# EAGLE design remote board v2 (EAGLE 5.10)
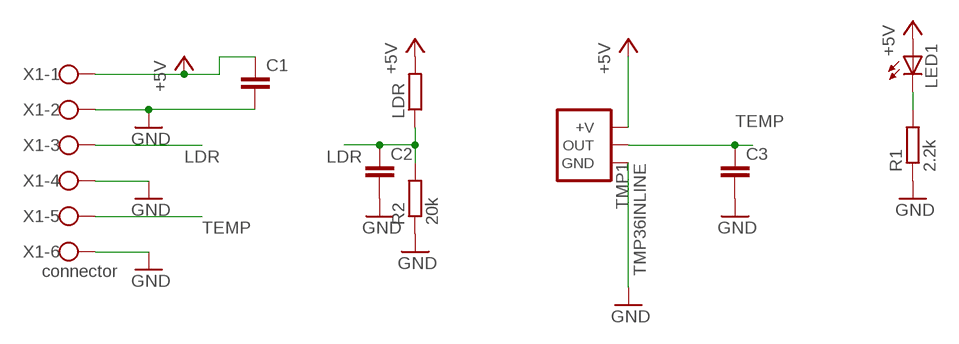
[diagram p0: schematic, sheet 1]

## Parts
C1  C-EU050-025X075  [C050-025X075]
C2  C-EU050-025X075  [C050-025X075]
C3  C-EU050-025X075  [C050-025X075]
LDR  R-EU_0204/7  [0204/7]
LED1  LED5MM  [LED5MM]
R1  2.2k  R-EU_0204/7  [0204/7]
R2  20k  R-EU_0204/7  [0204/7]
TMP1  TMP36INLINE  [TO92-INLINE]
X1  connector  W237-6  [W237-6]

## Nets
+5V [power]: C1.1 LDR.2 LED1.A TMP1.1(+V) X1.1
GND: C1.2 C2.2 C3.2 R1.1 R2.1 TMP1.3(GND) X1.2 X1.4 X1.6
LDR [power]: C2.1 LDR.1 R2.2 X1.3
N$1: LED1.K(C) R1.2
TEMP: C3.1 TMP1.2(OUT) X1.5

## Library data of the parts
C1-C3 = matt rcl:C-EU: CAPACITOR, European symbol
LDR R1 R2 = matt rcl:R-EU_: RESISTOR, European symbol
LED1 = matt led:LED: LED OSRAM: - CHIPLED LG R971, LG N971, LY N971, LG Q971, LY Q971, LO R971, LY R971 LH N974, LH R974 LS Q976, LO Q976, LY Q976 LO Q996 - Hyper CHIPLED LW Q18S LB Q993, LB Q99A, LB R99A - SideLED LS A670, LO A670, LY A670, LG A670, LP A670 LB A673, LV A673, LT A673, LW A673 LH A674 LY A675 LS A676, LA A676, LO A676, LY A676, LW A676 LS A679, LY A679, LG A679 - Hyper Micro SIDELED® LS Y876, LA Y876, LO Y876, LY Y876 LT Y87S - SmartLED LW L88C, LW L88S LB L89C, LB L89S, LG L890 LS L89K, LO L89K, LY L89K LS L896, LA L896, LO L896, LY L896 - TOPLED LS T670, LO T670, LY T670, LG T670, LP T670 LSG T670, LSP T670, LSY T670, LOP T670, LYG T670 LG T671, LOG T671, LSG T671 LB T673, LV T673, LT T673, LW T673 LH T674 LS T676, LA T676, LO T676, LY T676, LB T676, LH T676, LSB T676, LW T676 LB T67C, LV T67C, LT T67C, LS T67K, LO T67K, LY T67K, LW E67C LS E67B, LA E67B, LO E67B, LY E67B, LB E67C, LV E67C, LT E67C LW T67C LS T679, LY T679, LG T679 LS T770, LO T770, LY T770, LG T770, LP T770 LB T773, LV T773, LT T773, LW T773 LH T774 LS E675, LA E675, LY E675, LS T675 LS T776, LA T776, LO T776, LY T776, LB T776 LHGB T686 LT T68C, LB T68C - Hyper Mini TOPLED® LB M676 - Mini TOPLED Santana® LG M470 LS M47K, LO M47K, LY M47K Source: http://www.osram.convergy.de LUXEON: - LUMILED® LXK2-PW12-R00, LXK2-PW12-S00, LXK2-PW14-U00, LXK2-PW14-V00 LXK2-PM12-R00, LXK2-PM12-S00, LXK2-PM14-U00 LXK2-PE12-Q00, LXK2-PE12-R00, LXK2-PE12-S00, LXK2-PE14-T00, LXK2-PE14-U00 LXK2-PB12-K00, LXK2-PB12-L00, LXK2-PB12-M00, LXK2-PB14-N00, LXK2-PB14-P00, LXK2-PB14-Q00 LXK2-PR12-L00, LXK2-PR12-M00, LXK2-PR14-Q00, LXK2-PR14-R00 LXK2-PD12-Q00, LXK2-PD12-R00, LXK2-PD12-S00 LXK2-PH12-R00, LXK2-PH12-S00 LXK2-PL12-P00, LXK2-PL12-Q00, LXK2-PL12-R00 Source: www.luxeon.com KINGBRIGHT: KA-3528ASYC Source: www.kingbright.com
TMP1 = Chris:TMP36: TMP36
X1 = con-wago-500:W237-6: WAGO SCREW CLAMP

## Net classes
1 power: width 2 mm

## Board
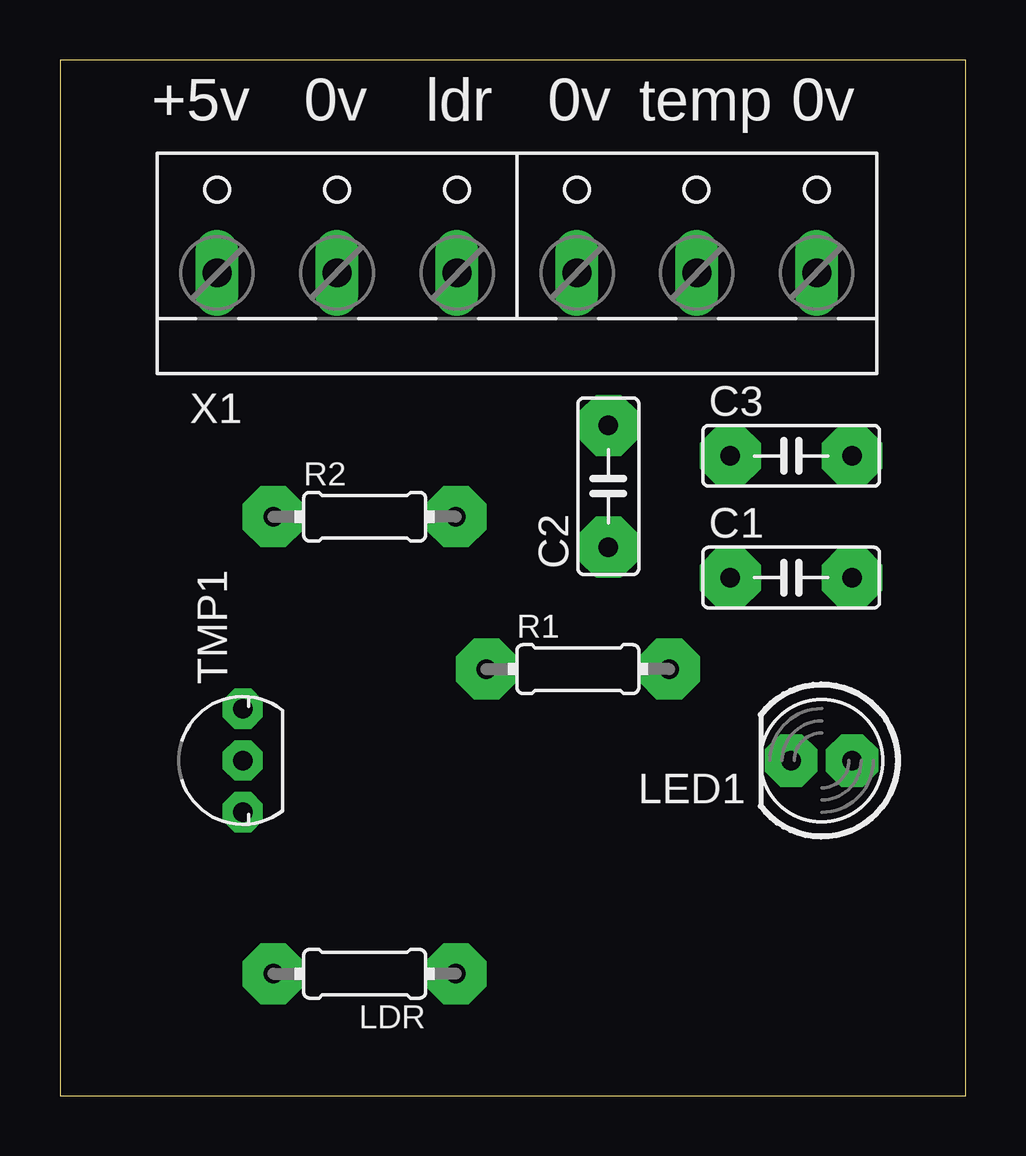
[diagram p1: board, top side]
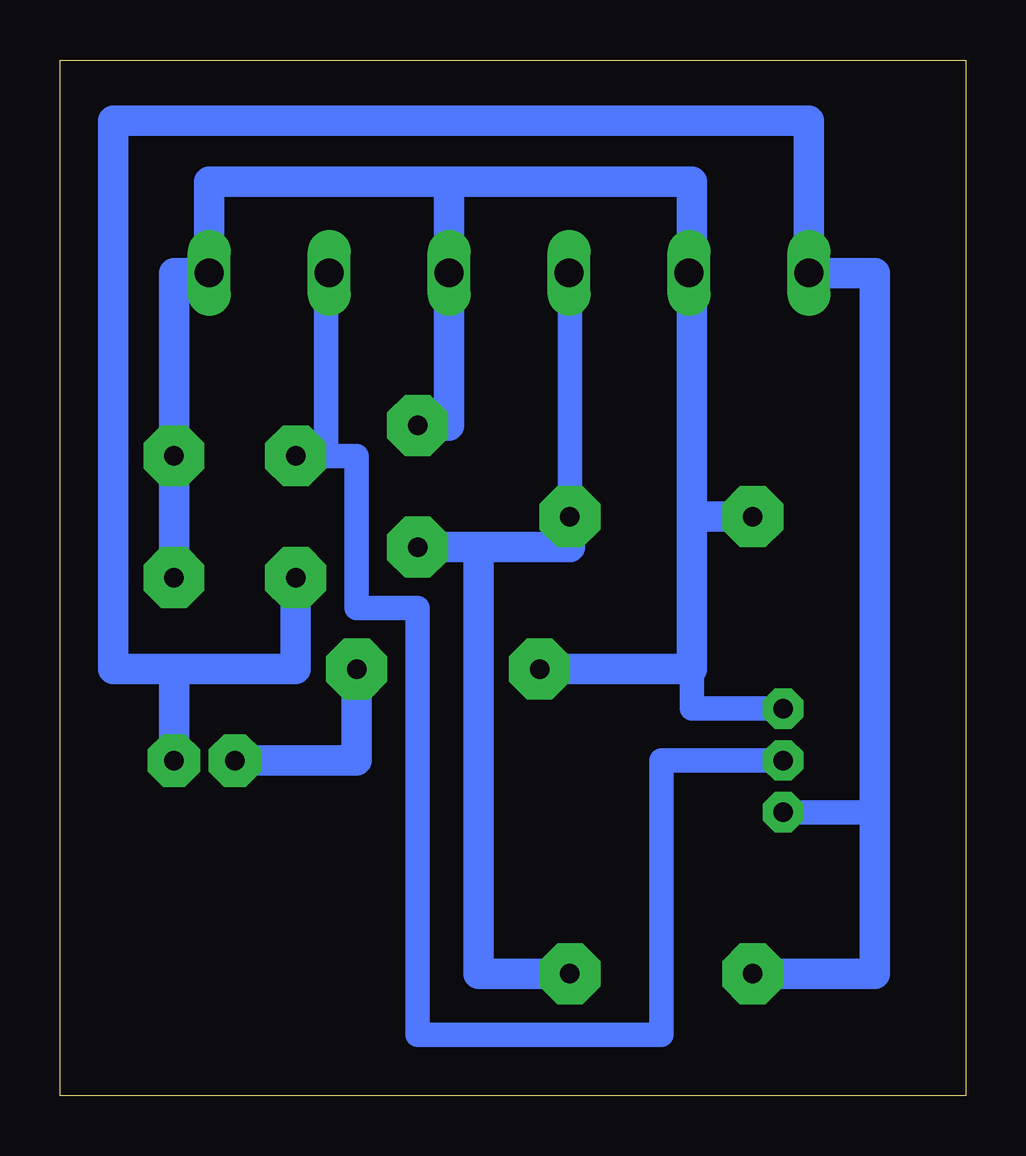
[diagram p2: board, bottom side, seen from below]

Size 37.77 x 43.17 mm. Coordinates in mm from the lower left corner, seen from the top.
Outline: 0,0 37.77,0 37.77,43.17 0,43.17 0,0
Copper layers (1*16): Top 0.035mm / dielectric 1.5mm / Bottom 0.035mm
Design rules "default": minimum track width 10mil, minimum drill 24mil, track to track 8mil, track to pad 8mil, pad to pad 8mil, via to via 8mil, smd to smd 8mil, copper to edge 40mil, drill to drill 8mil, minimum pad ring 10mil, minimum via ring 8mil, stop-mask expansion 4mil, vias tented up to drill 0mil, thermal gap 10mil

### Footprints (pad centres in the part's own frame; a part is rotated, then mirrored left to right if it is on the bottom)
C050-025X075 = drill 0.813 pad 2.54 octagon: 1 -2.54,0; 2 2.54,0
0204/7 = drill 0.813 pad 2.54 octagon: 1 -3.81,0; 2 3.81,0
LED5MM = drill 0.813 pad 2.184 octagon: A -1.27,0; K 1.27,0
TO92-INLINE = drill 0.813 pad 1.676 octagon: 1 -2.159,0; 2 0,0; 3 2.159,0
W237-6 = drill 1.194 long: 1 -12.5,-1.27; 2 -7.5,-1.27; 3 -2.5,-1.27; 4 2.5,-1.27; 5 7.5,-1.27; 6 12.5,-1.27

### Placement (x,y rotation side)
C1  30.48,21.59 0 top
C2  22.86,25.4 90 top
C3  30.48,26.67 0 top
LDR  12.7,5.08 180 top
LED1  31.75,13.97 180 top
R1  21.59,17.78 0 top
R2  12.7,24.13 0 top
TMP1  7.62,13.97 90 top
X1  19.05,35.56 0 top

### Tracks (layer width: path | path; a pad name or v marks a point on that pad's centre or on a via)
+5V
  Bottom 1.016: 3.81,16.51 3.81,16.13 | TMP1.1 3.81,11.81 3.81,11.43
  Bottom 1.27: 33.02,17.78 LED1.A | 33.02,17.78 27.94,17.78 C1.1 | LDR.2 3.81,5.08 3.81,11.43 3.81,16.51 3.81,34.29 X1.1 6.55,40.64 35.56,40.64 35.56,17.78 33.02,17.78
GND
  Bottom 0.406: R2.1 8.26,24.13 | 11.43,34.29 X1.2 | X1.4 21.59,34.29 21.59,38.1
  Bottom 1.016: 11.43,19.05 11.43,18.67 | TMP1.3 11.43,16.13 11.43,17.78
  Bottom 1.27: 11.43,24.13 11.43,34.29 11.43,38.1 21.55,38.1 X1.4 21.55,27.94 C2.2 | 11.43,24.13 R2.1 | 21.59,38.1 31.55,38.1 X1.6 33.02,34.29 C3.2 C1.2 | R1.1 11.43,17.78 11.43,19.05 11.43,24.13
LDR
  Bottom 1.016: X1.3 16.51,34.29 R2.2
  Bottom 1.27: 20.32,22.86 16.51,22.86 R2.2 | 20.32,22.86 C2.1 | LDR.1 20.32,5.08 20.32,22.86
N$1
  Bottom 1.27: LED1.K 25.4,13.97 R1.2
TEMP
  Bottom 1.016: TMP1.2 12.7,13.97 12.7,2.54 22.86,2.54 22.86,20.32 25.4,20.32 25.4,26.67 26.67,26.67 | X1.5 26.67,34.29 26.67,26.67 | 26.67,26.67 C3.1

### Text on the board
tPlace: +5v | 0v | ldr | 0v | temp | 0v